# Altium schematic sheet ATB-Motor.SchDoc
size A4
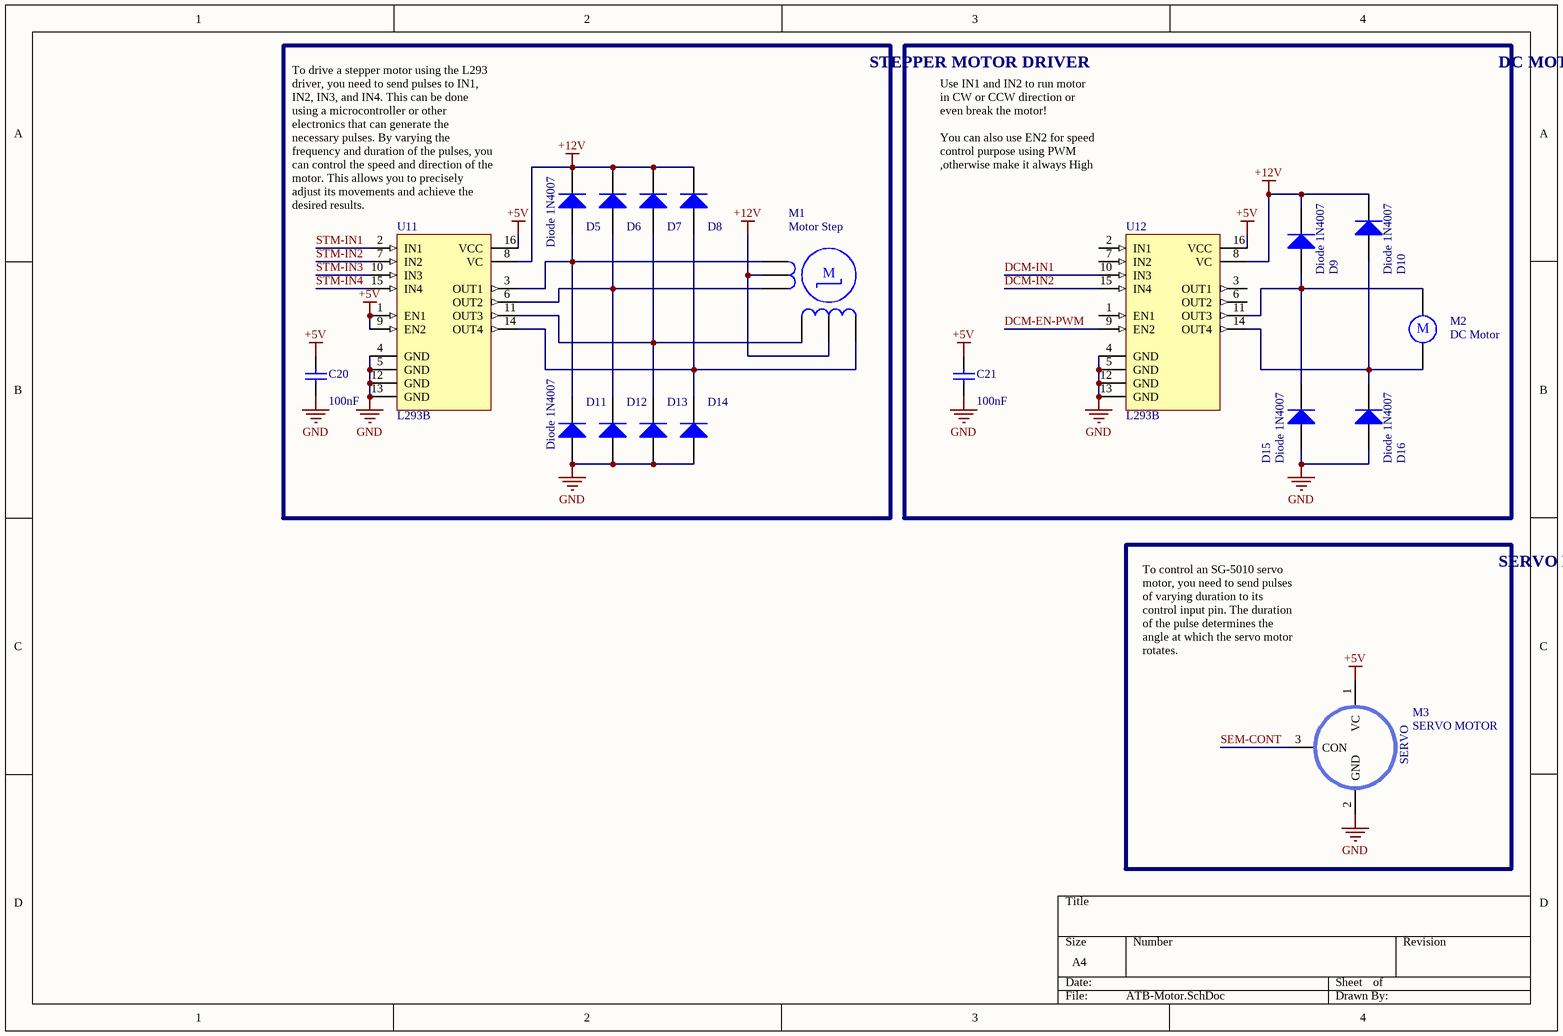
[diagram p0: ATB-Motor.SchDoc]

## Parts
C20  100nF  [SMD_C0805]
C21  100nF  [SMD_C0805]
D5  Diode 1N4007  [DO-41]
D6  Diode 1N4007  [DO-41]  (value not drawn)
D7  Diode 1N4007  [DO-41]  (value not drawn)
D8  Diode 1N4007  [DO-41]  (value not drawn)
D9  Diode 1N4007  [DO-41]
D10  Diode 1N4007  [DO-41]
D11  Diode 1N4007  [DO-41]
D12  Diode 1N4007  [DO-41]  (value not drawn)
D13  Diode 1N4007  [DO-41]  (value not drawn)
D14  Diode 1N4007  [DO-41]  (value not drawn)
D15  Diode 1N4007  [DO-41]
D16  Diode 1N4007  [DO-41]
M1  Motor Step  [Motor Step]
M2  DC Motor  [Motor DC 2cm]
M3  SERVO MOTOR  [Motor Sevro]
U11  L293B  [DIP16]
U12  L293B  [DIP16]

## Blocks framed on the sheet
STEPPER MOTOR DRIVER: C20 D5-D8 D11-D14 M1 U11
DC MOTOR DRIVER: C21 D9 D10 D15 D16 M2 U12
SERVO MOTOR: M3

## Nets
+5V: C20.2 C21.2 M3.1(VC) U11.1(EN1) U11.9(EN2) U11.16(VCC) U12.16(VCC)
+12V: D5.2(K) D6.2(K) D7.2(K) D8.2(K) D9.2(K) D10.2(K) M1.2 M1.5 U11.8(VC) U12.8(VC)
GND: C20.1 C21.1 D11.1(A) D12.1(A) D13.1(A) D14.1(A) D15.1(A) D16.1(A) M3.2(GND) U11.4(GND) U11.5(GND) U11.12(GND) U11.13(GND) U12.4(GND) U12.5(GND) U12.12(GND) U12.13(GND)
DCM-EN-PWM: U12.9(EN2)
DCM-IN1: U12.10(IN3)
DCM-IN2: U12.15(IN4)
SEM-CONT: M3.3(CON)
STM-IN1: U11.2(IN1)
STM-IN2: U11.7(IN2)
STM-IN3: U11.10(IN3)
STM-IN4: U11.15(IN4)
NetD5_1: D5.1(A) D11.2(K) M1.1 U11.3(OUT1)
NetD6_1: D6.1(A) D12.2(K) M1.3 U11.6(OUT2)
NetD7_1: D7.1(A) D13.2(K) M1.4 U11.11(OUT3)
NetD8_1: D8.1(A) D14.2(K) M1.6 U11.14(OUT4)
NetD9_1: D9.1(A) D15.2(K) M2.1 U12.11(OUT3)
NetD10_1: D10.1(A) D16.2(K) M2.2 U12.14(OUT4)

Not connected (* = marked no-connect by the designer): U12 1(EN1) 2(IN1) 3(OUT1) 6(OUT2) 7(IN2)

## Notes on the sheet
- Use IN1 and IN2 to run motor in CW or CCW direction or even break the motor!
  You can also use EN2 for speed control purpose using PWM ,otherwise make it always High
- (near U11) To drive a stepper motor using the L293 driver, you need to send pulses to IN1, IN2, IN3, and IN4. This can be done using a microcontroller or other electronics that can generate the necessary pulses. By varying the frequency and duration of the pulses, you can control the speed and direction of the motor. This allows you to precisely adjust its movements and achieve the desired results.
- (near M3) To control an SG-5010 servo motor, you need to send pulses of varying duration to its control input pin. The duration of the pulse determines the angle at which the servo motor rotates.
- (in symbol Motor) M
- (in symbol Motor Step) M
- (in symbol servo) SERVO

## Library data of the parts
C20 C21 = Cap: Capacitor; Published: 8-Jun-2000; LatestRevisionDate: 17-Jul-2002; LatestRevisionNote: Re-released for DXP Platform.; PackageReference: RAD-0.3; Publisher: Altium Limited; PackageDescription: Radial Cap, Thru-Hole; 2 Leads; 0.3 in Pin Spacing; Value: 100nF
D5-D16 = Diode 1N4007: 1 Amp General Purpose Rectifier; Published: 8-Jun-2000; LatestRevisionDate: 17-Jul-2002; LatestRevisionNote: Re-released for DXP Platform.; DatasheetDocument: 1998; PackageDocument: Aug-1999; PackageReference: DO-41; Publisher: Altium Limited; Code_JEDEC: DO-204-AL; ComponentLink1Description: Manufacturer Link; ComponentLink1URL: http://www.fairchildsemi.com/; ComponentLink2Description: Datasheet; ComponentLink2URL: http://www.fairchildsemi.com/ds/1N%2F1N4001.pdf
M1 = Motor Step: Motor Stepper; Published: 24-Mar-1999; LatestRevisionDate: 17-Jul-2002; LatestRevisionNote: Re-released for DXP Platform.; PackageReference: DIP-6; Publisher: Altium Limited; Code_JEDEC: MO-001-AM
M2 = Motor: Motor, General Kind; Published: 24-Mar-1999; LatestRevisionDate: 17-Jul-2002; LatestRevisionNote: Re-released for DXP Platform.; PackageReference: RB5-10.5; Publisher: Altium Limited
M3 = servo: pin to pad: 1>2 2>1
U11 U12 = L293B: Push-Pull Four Channel Drivers; Published: 8-Jun-2000; LatestRevisionDate: 06-Jun-2005; LatestRevisionNote: Stylized 3D Model Added.; DatasheetVersion: Apr-1993; PackageVersion: Apr-1996; PackageReference: DIP16; Publisher: Altium Limited; PackageDescription: DIP; 16 Leads; Row Spacing 7.62 mm; Pitch 2.54 mm; ComponentLink1Description: Manufacturer Link; ComponentLink1URL: http://www.st.com/; ComponentLink2Description: Datasheet; ComponentLink2URL: http://www.st.com/stonline/products/literature/ds/1328/l293b.pdf